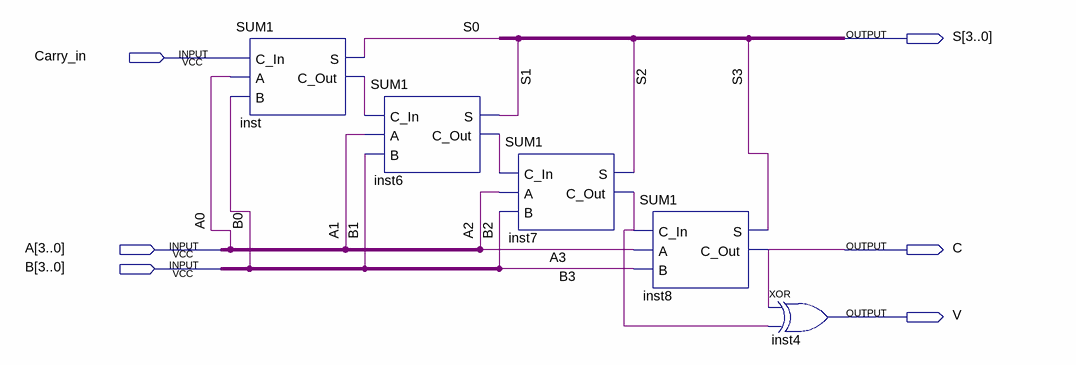
[diagram p0: schematic sheet]
// Quartus schematic SUM4_FLAGS.bdf as structural Verilog: 5 symbols, 6 pins
module SUM4_FLAGS (
  input  Carry_in,
  input  [3:0] A,
  input  [3:0] B,
  output [3:0] S,
  output C,
  output V
);

  wire inst6_c_out, inst7_c_out, inst_c_out;

  SUM1 inst (.C_In(Carry_in), .A(A[0]), .B(B[0]), .S(S[0]), .C_Out(inst_c_out));
  SUM1 inst6 (.C_In(inst_c_out), .A(A[1]), .B(B[1]), .S(S[1]), .C_Out(inst6_c_out));
  SUM1 inst7 (.C_In(inst6_c_out), .A(A[2]), .B(B[2]), .S(S[2]), .C_Out(inst7_c_out));
  SUM1 inst8 (.C_In(inst7_c_out), .A(A[3]), .B(B[3]), .S(S[3]), .C_Out(C));
  xor inst4 (V, C, inst7_c_out);
endmodule
